# Altium schematic sheet EEPROM_FLASH.SchDoc
size A4; Organization: Protel International P/L; Address1: L3, 12a Rodborough Rd; Address2: Frenchs Forest; Address3: NSW; Address4: Australia 2086
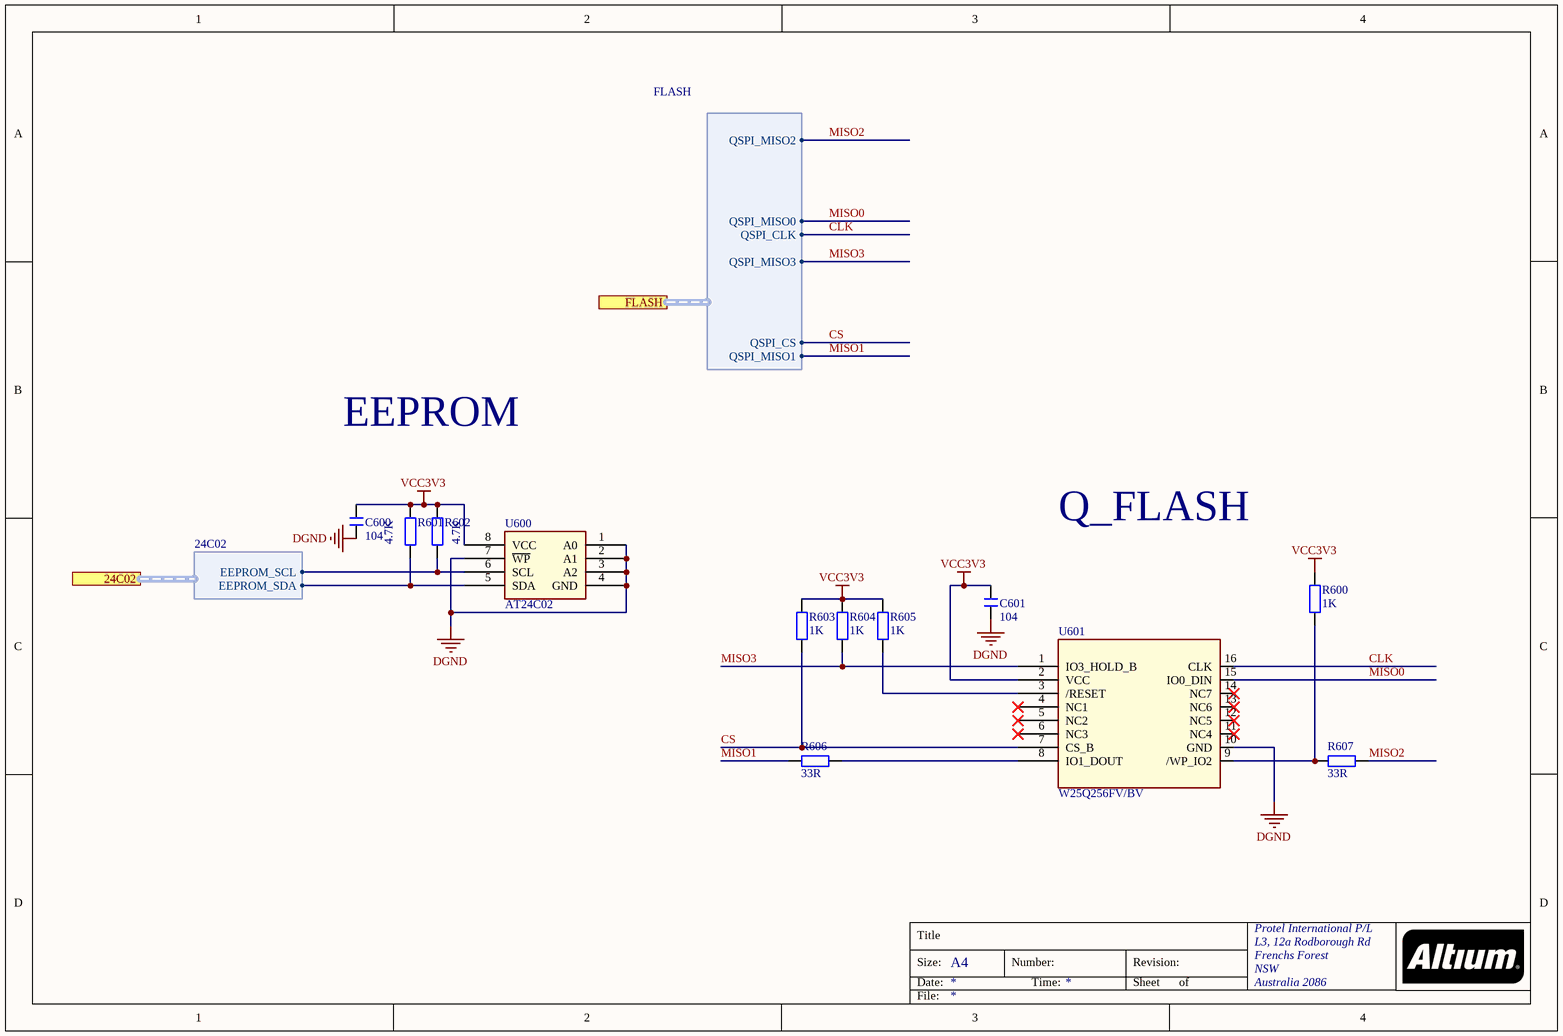
[diagram p0: EEPROM_FLASH.SchDoc]

## Parts
C600  104  [C 0402_M]
C601  104  [C 0402_M]
R600  1K  [R 0402_M]
R601  4.7K  [R 0402_M]
R602  4.7K  [R 0402_M]
R603  1K  [R 0402_M]
R604  1K  [R 0402_M]
R605  1K  [R 0402_M]
R606  33R  [R 0402_M]
R607  33R  [R 0402_M]
U600  AT24C02  [SOP8_M]
U601  W25Q256FV/BV  [SOP16W_M]

## Ports
24C02 (harness 24C02), FLASH (harness FLASH)

## Harnesses
24C02: EEPROM_SCL, EEPROM_SDA
FLASH: QSPI_MISO3, QSPI_CS, QSPI_MISO1, QSPI_CLK, QSPI_MISO0, QSPI_MISO2

## Nets
DGND: C600.1 C601.1 U600.1(A0) U600.2(A1) U600.3(A2) U600.4(GND) U600.7(~{WP}) U601.10(GND)
VCC3V3: C600.2 C601.2 R600.2 R601.2 R602.2 R603.2 R604.2 R605.2 U600.8(VCC) U601.2(VCC)
CLK: U601.16(CLK) ; port FLASH.QSPI_CLK
CS: R603.1 U601.7(CS_B) ; port FLASH.QSPI_CS
MISO0: U601.15(IO0_DIN) ; port FLASH.QSPI_MISO0
MISO1: R606.2 ; port FLASH.QSPI_MISO1
MISO2: R607.2 ; port FLASH.QSPI_MISO2
MISO3: R604.1 U601.1(IO3_HOLD_B) ; port FLASH.QSPI_MISO3
NetR600_1: R600.1 R607.1 U601.9(/WP_IO2)
NetR601_1: R601.1 U600.5(SDA) ; port 24C02.EEPROM_SDA
NetR602_1: R602.1 U600.6(SCL) ; port 24C02.EEPROM_SCL
NetR605_1: R605.1 U601.3(/RESET)
NetR606_1: R606.1 U601.8(IO1_DOUT)

Not connected (* = marked no-connect by the designer): U601 4(NC1)* 5(NC2)* 6(NC3)* 11(NC4)* 12(NC5)* 13(NC6)* 14(NC7)*

## Notes on the sheet
- EEPROM
- Q_FLASH
- Title
- Size:
- Date:
- A4
- Number:
- Time:
- Revision:
- Sheet
- of
- File:

## Library data of the parts
C600 C601 = C: 无极性贴片电容; 版权归属: 源创客; BOM名称: 无极性贴片电容; 学习资源: www.ooocke.com
R600-R607 = R: 贴片电阻; 版权归属: 源创客; BOM名称: 贴片电阻; 学习资源: www.ooocke.com